# Altium schematic sheet Sheet2.SchDoc
size B; SheetNumber: 1; SheetTotal: 1
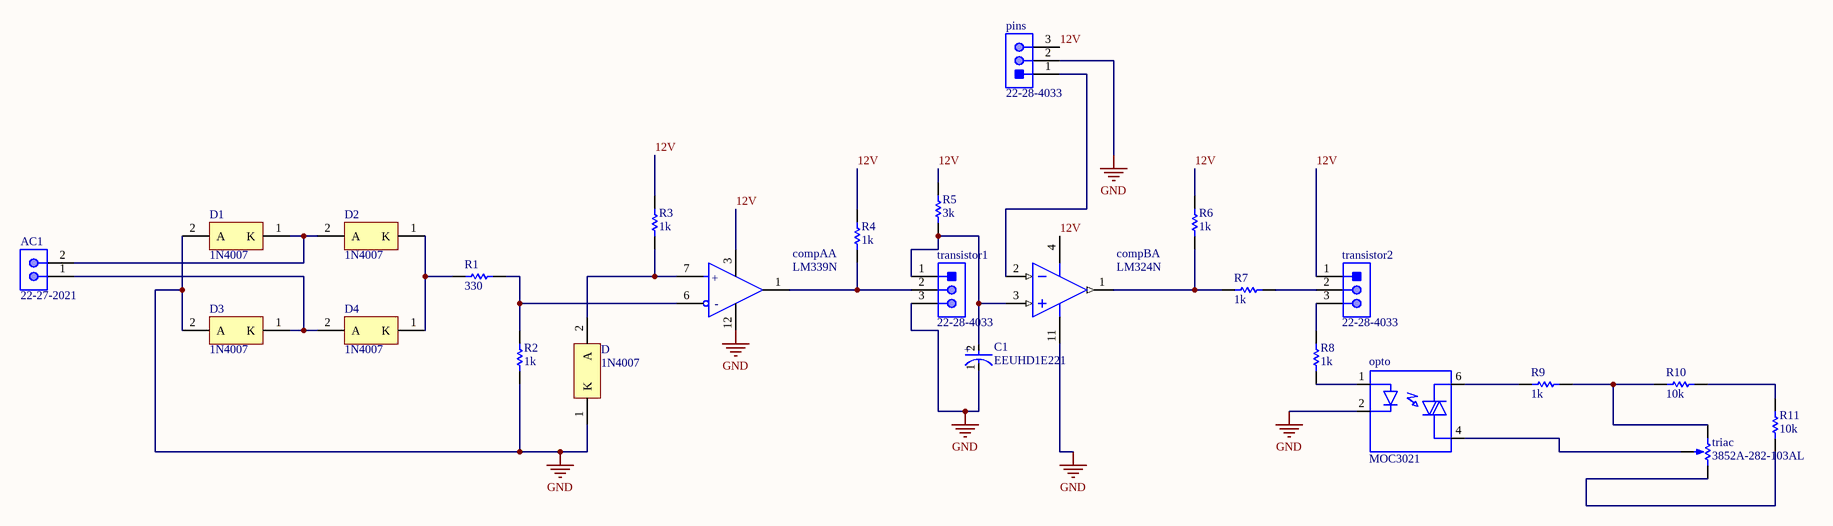
[diagram p0: Sheet2.SchDoc]

## Parts
AC1  22-27-2021  [MOLX-22-27-2021_V]
C1  EEUHD1E221  [FP-RAD-TH-D_8_0_5-L_11_5-MFG]
compA  LM339N  [FP-N0014A-MFG]  (part A of 4)
compB  LM324N  [N0014A]  (part A of 4)
D  1N4007  [ONSC-AXIAL_LEAD-2-59-10_P]
D1  1N4007  [ONSC-AXIAL_LEAD-2-59-10_P]
D2  1N4007  [ONSC-AXIAL_LEAD-2-59-10_P]
D3  1N4007  [ONSC-AXIAL_LEAD-2-59-10_P]
D4  1N4007  [ONSC-AXIAL_LEAD-2-59-10_P]
opto  MOC3021  [DIP762W45P254L889H508Q6]
pins  22-28-4033  [MOLX-22-28-4033_V]
R1  330  [RESA60-630X240]
R2  1k  [RESA60-630X240]
R3  1k  [RESA60-630X240]
R4  1k  [RESA60-630X240]
R5  3k  [RESA60-630X240]
R6  1k  [RESA60-630X240]
R7  1k  [RESA60-630X240]
R8  1k  [RESA60-630X240]
R9  1k  [RESA60-630X240]
R10  10k  [RESA60-630X240]
R11  10k  [RESA60-630X240]
transistor1  22-28-4033  [MOLX-22-28-4033_V]
transistor2  22-28-4033  [MOLX-22-28-4033_V]
triac  3852A-282-103AL  [BOUR-3852A-282-103AL-3_V]

## Nets
GND: C1.1(C) compA.12(GND) compB.11(GND) D.1(K) D1.2(A) D3.2(A) opto.2(CATODE) pins.2 R2.2 transistor1.3
12V: compA.3(VCC) compB.4(V+) pins.3 R3.1 R4.1 R5.1 R6.1 transistor2.1
NetAC1_1: AC1.1 D3.1(K) D4.2(A)
NetAC1_2: AC1.2 D1.1(K) D2.2(A)
NetC1_2: C1.2(A) compB.3(IN1+) R5.2 transistor1.1
NetcompA_1: compA.1(1OUT) R4.2 transistor1.2
NetcompA_6: compA.6(1IN-) R1.1 R2.1
NetcompA_7: compA.7(1IN+) D.2(A) R3.2
NetcompB_1: compB.1(OUT1) R6.2 R7.2
NetcompB_2: compB.2(IN1-) pins.1
NetD2_1: D2.1(K) D4.1(K) R1.2
Netopto_1: opto.1(ANODE) R8.2
Netopto_4: opto.4(MAIN_TERM2) triac.2(S)
Netopto_6: opto.6(MAIN_TERM1) R9.2
NetR7_1: R7.1 transistor2.2
NetR8_1: R8.1 transistor2.3
NetR9_1: R9.1 R10.1 triac.1(CCW)
NetR10_2: R10.2 R11.2
NetR11_1: R11.1 triac.3(CW)

## Notes on the sheet
- (in symbol CMP-0055-00143-4, part A) +; -
- (in symbol CMP-05427-001200-1) +

## Library data of the parts
AC1 = CMP-2000-05537-1: Male Header, Pitch 2.54 mm, 1 x 2 Position, Height 11.7 mm, Tail Length 3.56 mm, 0 to 75 degC, RoHS, Bulk; Manufacturer: Molex; PartNumber: 0022272021; Current rating: 4A; Package Version: Rev. BC, 02/2012; Voltage rating: 250V; No. of Positions: 2; Pitch: 2.54mm; No. of Rows: 1; Orientation: Vertical; Operating temperature: 0°Cto+75°C; Manufacturer URL: http://www.molex.com/; Mounting Technology: ThroughHole; Housing material: Nylon(UL94V-0); Package Description: 2-Leads Header, Body 5.08 x 5.8 mm, Pitch 2.54 mm; Voltage - Max: 250V; Datasheet URL: http://www.molex.com/pdm_docs/sd/022272021_sd.pdf; Package Reference: 22-27-2021; Contact material: Tinplatedbrass; Current - Max: 4A; Datasheet Version: Rev. F, 06/2009
C1 = CMP-05427-001200-1: Aluminum Electrolytic Capacitors (Radial Lead Type) AEC-Q200 Qualified 220uF ±20% 25V; Ripple Current (AC): 230mA; Polarity: Polar; Lead Diameter: 0.6mm; Lead/Base Style: Straight; Life (Hours): 1000Hour; Voltage Rating (DC): 25V; Max Operating Temperature: 105°C; Case/Package: Radial; Termination: Radial; Package Quantity: 200; Voltage: 25V; Height: 11.5mm; Capacitance: 220uF; Ripple Current: 230mA; Tolerance: 20%; Mount: Through Hole; Construction: RADIAL; Diameter: 8mm; RoHS Compliant: Yes; Voltage Rating: 25V; Lead Pitch: 3.5mm; Contact Plating: Tin; Height - Seated (Max): 0.512inch; Series: HD; Min Operating Temperature: -55°C; Number of Pins: 2; REACH SVHC: No SVHC; Packaging: Bulk; Length: 11.5mm
compA = CMP-0055-00143-4: IC QUAD DIFF COMPARATOR 14-DIP; Power Dissipation: 1.05kW; Response Time: 1.3us; Max Input Current: 250nA; Max Supply Current: 500uA; Output Current: 20mA; Output Type: TTL; Max Dual Supply Voltage: 15V; Voltage Gain: 106.02dB; Min Supply Voltage: 2V; Max Power Dissipation: 1.05W; Quiescent Current: 2.5mA; Nominal Supply Current: 2mA; Input Offset Voltage (Vos): 5mV; Number of Channels: 4; Output Current per Channel: 6mA; Max Supply Voltage: 30V; Min Dual Supply Voltage: 1V; Dual Supply Voltage: 9V; REACH SVHC: No SVHC; Max Operating Temperature: 70°C; Case/Package: PDIP; Weight: 0.032734oz; Radiation Hardening: No; Min Operating Temperature: 0°C; Number of Pins: 14; Contact Plating: Gold; Package Quantity: 25; Lead Free: Lead Free; Height: 4.57mm; Packaging: Rail/Tube; Input Bias Current: 250nA; Number of Elements: 4; Mount: Through Hole; Width: 6.35mm; Length: 19.3mm
compB = CMP-0055-00082-3: Low Power Quad Operational Amplifier, 14-pin MDIP; Manufacturer: Texas Instruments; CompType: Amplifiers; PowerWise: N; PackageTopMarking: NSUZXYYTTE#*LM324N; PackageDescription: MDIP, .750 x .250 x.130in, 14 Lead, .100in Pitch; Package Reference: N0014A; RoHS: N; Code_JEDEC: MS-001-AA; ComponentLink1URL: http://www.ti.com/general/docs/lit/getliterature.tsp?genericPartNumber=LM324&fileType=pdf; ComponentLink1Description: Datasheet URL; PinCount: 14
D D1-D4 = CMP-0902-00142-1: Standard Recovery Rectifier, 2-Pin Axial_Lead, Pb-Free, Bulk Bag; Manufacturer: On Semiconductor; IO(rec) Max (A): 1; IFSM Max (A): 30; VRRM Max (V): 1000; ComponentLink3URL: http://www.onsemi.cn/pub_link/Collateral/59-10.PDF; PackageVersion: Rev. U, 02/2005; PackageDescription: 2-Pin, Axial Lead, Diameter 2.35 mm; PackageReference: AXIAL_LEAD-2-59-10; RoHS: TRUE; PartNumber: 1N4007; Packing: Bulk Bag; DatasheetVersion: Rev. 13; ComponentLink3Description: Package Specification; ComponentLink1Description: Manufacturer URL; ComponentLink2URL: http://www.onsemi.com/pub_link/Collateral/1N4001-D.PDF; ComponentLink1URL: http://www.onsemi.com/; Type: Standard Recovery; ComponentLink2Description: Datasheet; Mounting Technology: Through Hole
opto = MOC3021: Optoisolator Triac Output 5000Vrms 1 Channel 6-DIP; MF: Lite-On; MP: MOC3021; SnapEDA_Link: https://www.snapeda.com/parts/MOC3021/Lite-On/view-part/4551083/?ref=snap; Availability: Unavailable; Package: DIP-6 Lite-On; Value: *; Price: None
pins transistor1 transistor2 = CMP-1676-00001-5: Male Header, Pitch 2.54 mm, 1 x 3 Position, Height 8.38 mm, Tail Length 3.18 mm, RoHS, Bulk; Manufacturer: Molex; Rows: 1; Voltage Rating: 250 V; Current Rating: 4 A; Min Operating Temperature: 0 degC; Lead Pitch: 0.1 inch; Packaging: Bulk; Contact Finish: Gold; RoHSCompliant: true; Contact Material: Brass; PackageReference: 22-28-4033; REACH SVHC: Unknown; PackageDescription: Male Header, Pitch 2.54 mm, 1 x 3 Position, Height 8.38 mm, Tail Length 3.18 mm; ComponentLink2URL: http://www.molex.com/pdm_docs/sd/022284033_sd.pdf; Height: 8.38 mm; Mounting Technology: Through Hole; ComponentLink1Description: Manufacturer URL; Length: 7.62 mm; Mount: Through Hole; DatasheetVersion: Rev. G, 01/2012; Max Operating Temperature: 75 degC; ComponentLink2Description: Datasheet; Colour: Black; Pins: 3; Contact Plating: Gold; Package Quantity: 1; ComponentLink1URL: http://www.molex.com/
R1-R11 = CMP-1659-00075-1: Axial Resistor, 1 KOhm, +/- 1%, 250 mW, -55 to 155 degC, 2-Pin THD, RoHS, Bulk; Voltage Rating: 250 V; Resistance: 10 kohm; Power Rating: 250 mW; ComponentLink2Description: Datasheet; RoHSCompliant: true; PackageReference: MFR-25; Case\Package: Axial; Max Operating Temperature: 155 degC; DatasheetVersion: Apr-13; Tolerance: 1%; ComponentLink1URL: http://www.yageo.com/; Length: 0.248 inch; ComponentLink2URL: http://www.yageo.com/documents/recent/Yageo%20LR_MFR_2013.pdf; Packaging: Bulk; Package Quantity: 200; PackageDescription: 2-Pin Axial Lead, Dia 2.4 mm, Body Length 6.3 mm; Min Operating Temperature: -55 degC; ComponentLink1Description: Manufacturer URL
triac = CMP-2000-05079-1: Diameter Panel Control, 10 KOhm, +/- 10%, 2 W, -1 to 125 degC, 3-Pin THD, RoHS, Bulk; Manufacturer: Bourns; Temperature Coefficient: ±150ppm/degC; Number of Gangs: 1; Other Names: 3852A282103AL; Actuator Length: 0.875"(22.23mm); Resistive Material: Cermet; PCN Design/Specification: PBTResinJun/2011; Rotation: 280deg; PCN Other: MultipleChanges01/Dec/2012; Catalog Drawings: 3852SeriesSide1 / 3852SeriesSide2; Online Catalog: 3852and3856Series; Associated Product: 36-8560-ND / -KNOBINSTRUMW/DIALRND.9"DIA / 36-8555-ND / -KNOBINSTRUMSKIRTEDRND.7"DIA / 36-8556-ND / -KNOBINSTRUMSKIRTEDRND.9"DIA / 36-8565-ND / -KNOBINSTRUMDBLBARRND.7"DIA / 36-8566-ND / -KNOBINSTRUMDBLBARRND.9"DIA / 36-8568-ND / -KNOBINSTRUMSGLBARRND.7"DIA / 36-8569-ND / -KNOBINSTRUMSGLBARRND.9"DIA / 36-8559-ND / -KNOBINSTRUMW/DIALRND.7"DIA / 226-1006-ND / -KNOBBLKGLOSS.75"DIA.250"SHAFT / 226-1007-ND / -KNOBBLKGLOSS.925"DIA.250"SHAFT / 226-1011-ND / -KNOBBLKGLOS; Actuator Diameter: 0.250"(6.35mm); Built in Switch: None; Resistance (Ohms): 10k; Power (Watts): 2W; Actuator Type: Slotted; Standard Package: 45; Tolerance: ±10%; Taper: Linear; Series: 3852; Packaging: Bulk; Category: Potentiometers,VariableResistors; Bushing Thread: 3/8-32; Datasheet URL: https://datasheet.ciiva.com/11831/0900766b80f93b4b-11831016.pdf; Datasheet Version: Sep-14; Number of Turns: 1; Family: RotaryPotentiometers,Rheostats; Termination Style: SolderLug; RoHS Information: 3852A-LMaterialDeclaration; Mounting Type: PanelMount; Manufacturer URL: http://www.bourns.com/